# EAGLE design lcdpanel (EAGLE 6.5.0)
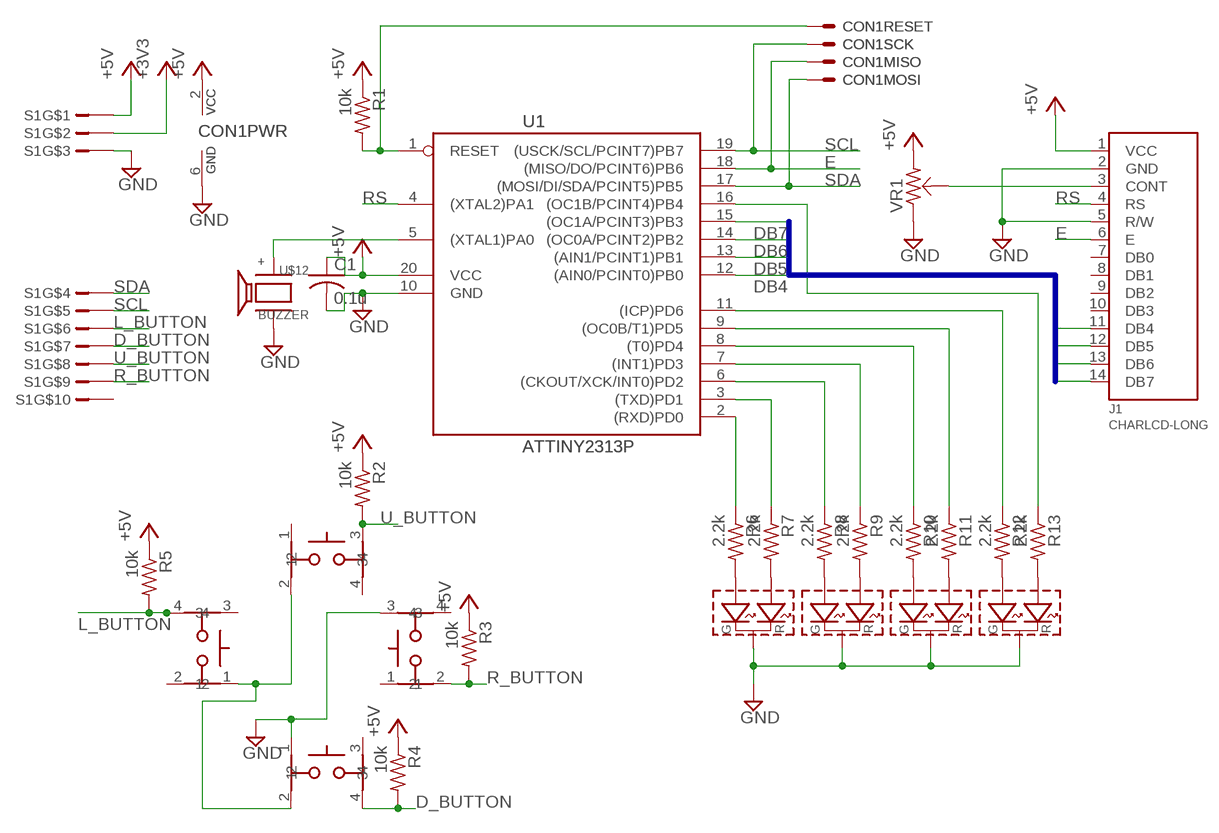
[diagram p0: schematic, sheet 1]

## Parts
C1  0.1u  C-2012  [2012-C]
CON1  AVRISP-NEWSYMBOL-ML6  [ML6]
D1  LED-RG-3MM  [LED-2COL-3MM]
D2  LED-RG-3MM  [LED-2COL-3MM]
D3  LED-RG-3MM  [LED-2COL-3MM]
D4  LED-RG-3MM  [LED-2COL-3MM]
J1  CHARLCD-LONG  [CHARLCD-7X2-LONG]
R1  10k  R-1608  [1608]
R2  10k  R-1608  [1608]
R3  10k  R-1608  [1608]
R4  10k  R-1608  [1608]
R5  10k  R-1608  [1608]
R6  2.2k  R-1608  [1608]
R7  2.2k  R-1608  [1608]
R8  2.2k  R-1608  [1608]
R9  2.2k  R-1608  [1608]
R10  2.2k  R-1608  [1608]
R11  2.2k  R-1608  [1608]
R12  2.2k  R-1608  [1608]
R13  2.2k  R-1608  [1608]
S1  10B-PH  [S10B-PH]
SW1  PUSHSW  [PUSHSW]
SW2  PUSHSW  [PUSHSW]
SW3  PUSHSW  [PUSHSW]
SW4  PUSHSW  [PUSHSW]
U1  ATTINY2313P  [DIL20]
U$12  BUZZER  [BUZZER]
VR1  VR  [VR-637A]

## Nets
+3V3: S1.P$2
+5V: C1.1 CON1.2(PWR:VCC) J1.1(VCC) R1.1 R2.1 R3.1 R4.1 R5.1 S1.P$1 U1.20(VCC) VR1.2
D_BUTTON: R4.2 S1.P$7 SW4.4
DB4: J1.11(DB4) U1.12((AIN0/PCINT0)PB0)
DB5: J1.12(DB5) U1.13((AIN1/PCINT1)PB1)
DB6: J1.13(DB6) U1.14((OC0A/PCINT2)PB2)
DB7: J1.14(DB7) U1.15((OC1A/PCINT3)PB3)
E: CON1.1(MISO:S) J1.6(E) U1.18((MISO/DO/PCINT6)PB6)
GND: C1.2 CON1.6(PWR:GND) D1.K D2.K D3.K D4.K J1.2(GND) J1.5(R/W) S1.P$3 SW3.3 SW4.1 U1.10(GND) U$12.- VR1.1
L_BUTTON: R5.2 S1.P$6 SW2.4
N$1: CON1.5(RESET:S) R1.2 U1.1(RESET)
N$2: SW1.2 SW2.1 SW4.2
N$3: J1.3(CONT) VR1.BR
N$4: D1.YG(G_A) R6.2
N$5: D1.R(R_A) R7.2
N$6: D2.YG(G_A) R8.2
N$7: D3.YG(G_A) R10.2
N$8: D3.R(R_A) R11.2
N$9: D4.YG(G_A) R12.2
N$10: D4.R(R_A) R13.2
N$11: D2.R(R_A) R9.2
N$12: R6.1 U1.2((RXD)PD0)
N$13: R7.1 U1.3((TXD)PD1)
N$14: R8.1 U1.6((CKOUT/XCK/INT0)PD2)
N$15: R9.1 U1.7((INT1)PD3)
N$16: R10.1 U1.8((T0)PD4)
N$17: R11.1 U1.9((OC0B/T1)PD5)
N$18: R12.1 U1.11((ICP)PD6)
N$19: R13.1 U1.16((OC1B/PCINT4)PB4)
N$20: U1.5((XTAL1)PA0) U$12.+
R_BUTTON: R3.2 S1.P$9 SW3.2
RS: J1.4(RS) U1.4((XTAL2)PA1)
SCL: CON1.3(SCK:S) S1.P$5 U1.19((USCK/SCL/PCINT7)PB7)
SDA: CON1.4(MOSI:S) S1.P$4 U1.17((MOSI/DI/SDA/PCINT5)PB5)
U_BUTTON: R2.2 S1.P$8 SW1.3
Unconnected: J1.7(DB0) J1.8(DB1) J1.9(DB2) J1.10(DB3) S1.P$10 SW1.1 SW1.4 SW2.2 SW2.3 SW3.1 SW3.4 SW4.3

## Buses
DB[4..7]

## Library data of the parts
C1 = Passive_Robotech:C
CON1 = Connector_Robotech:AVRISP-NEWSYMBOL
D1-D4 = pizaid:LED-RG
J1 = pizaid:CHARLCD
R1-R13 = Passive_Robotech:R
S1 = con-jst:?10B-PH
SW1-SW4 = Passive_Robotech:PUSHSW
U1 = MicroControler_Robotech:ATTINY2313
U$12 = pizaid:BUZZER
VR1 = Passive_Robotech:VR

## Board
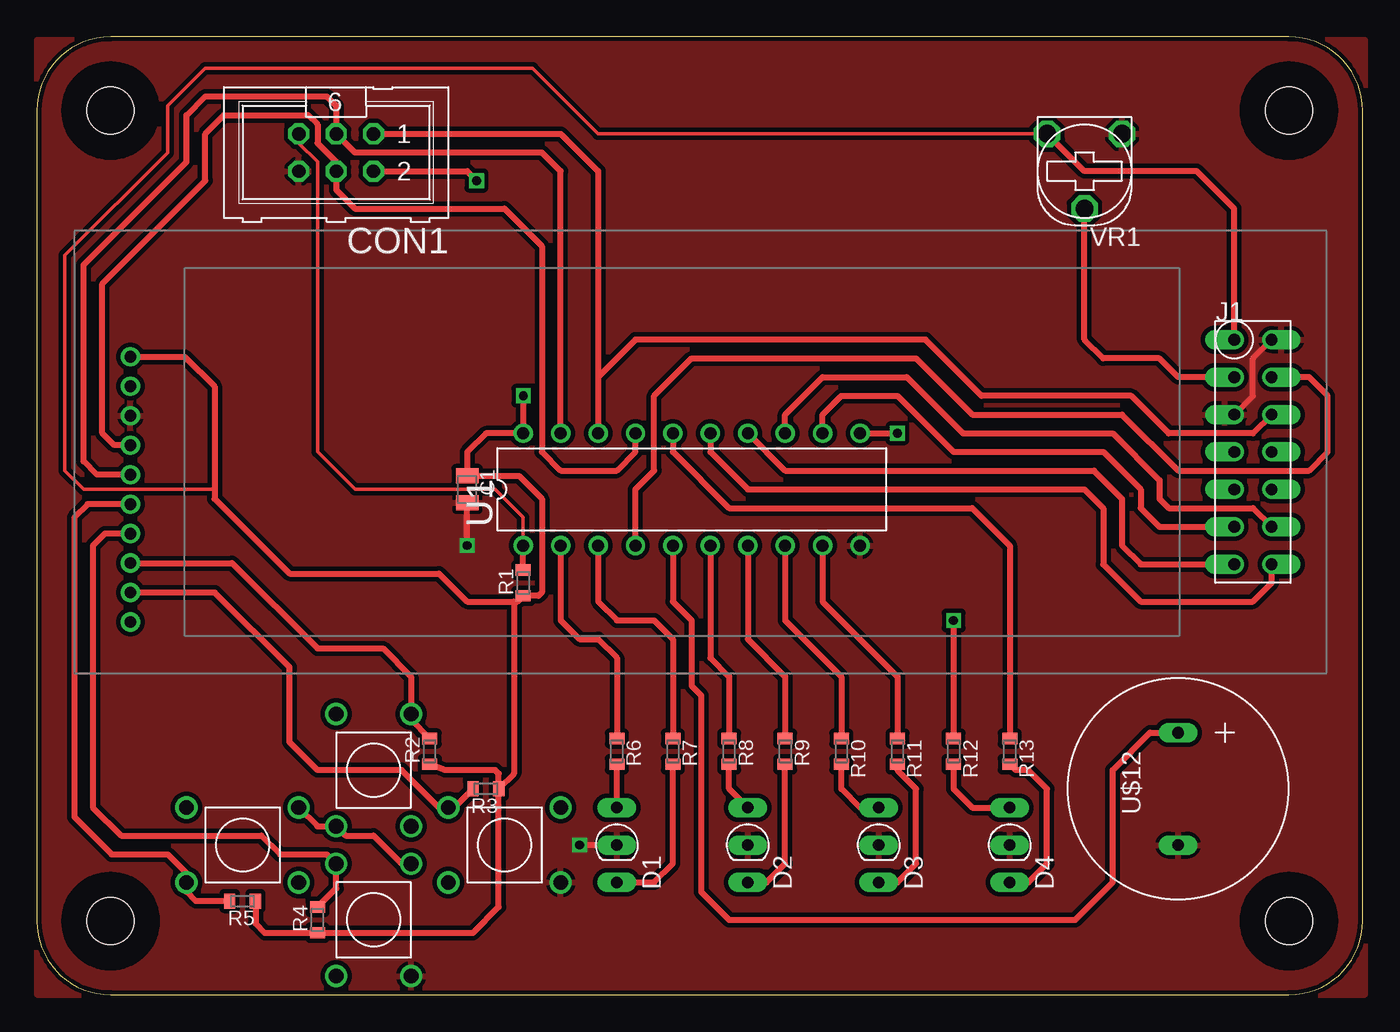
[diagram p1: board, top side]
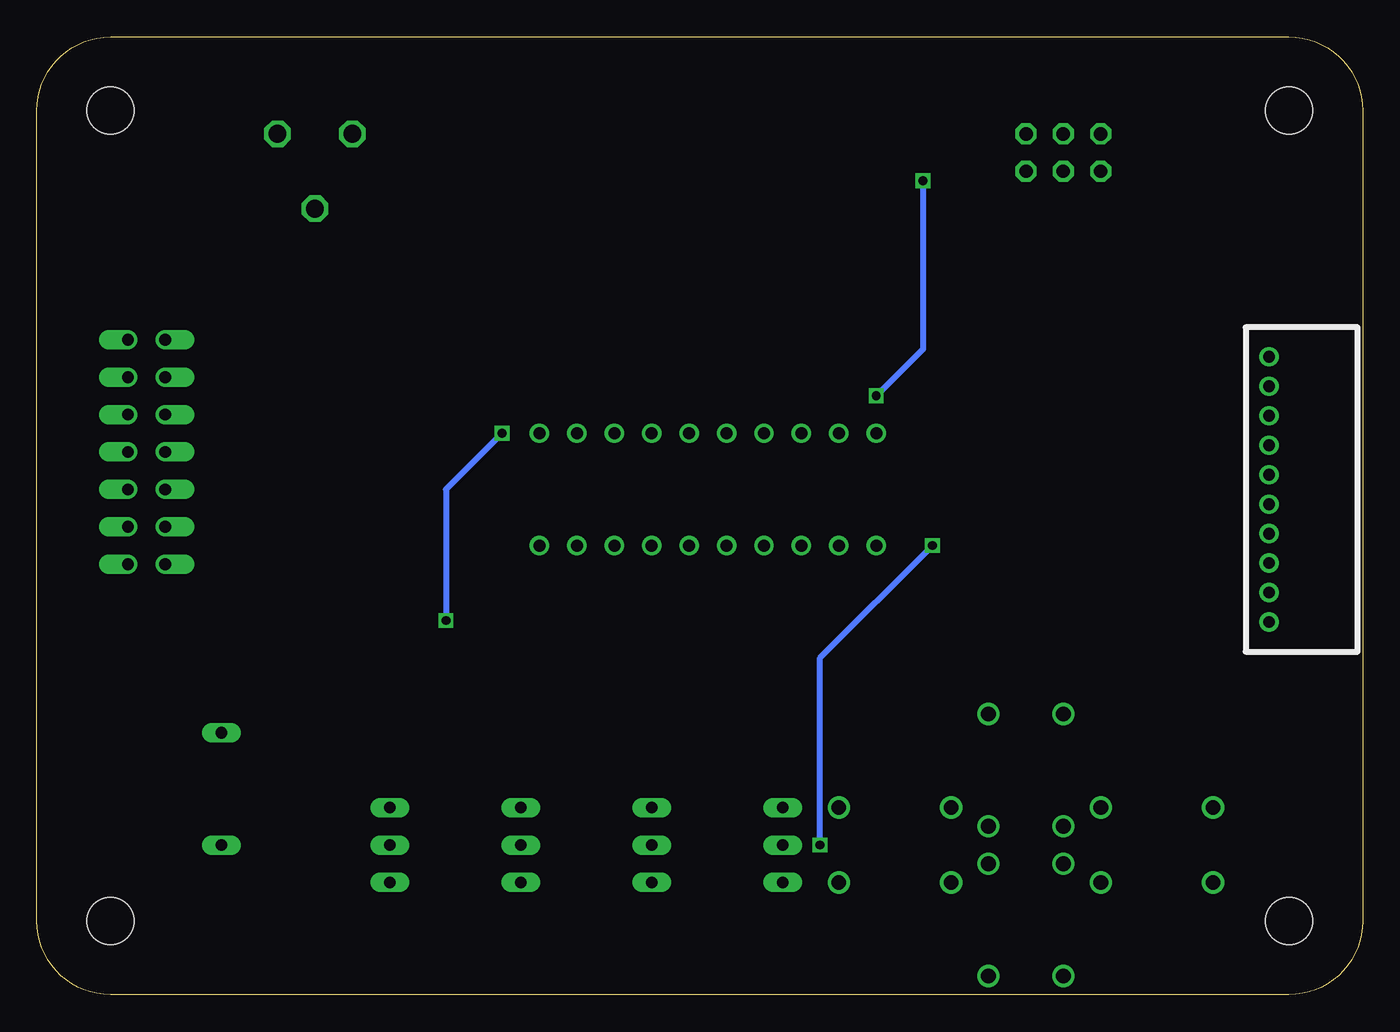
[diagram p2: board, bottom side, seen from below]

Size 90 x 65 mm. Coordinates in mm from the lower left corner, seen from the top.
Outline: 0,5 arc90 5,0 85,0 arc90 90,5 90,60 arc90 85,65 5,65 arc90 0,60 0,5
Copper layers (1*16): Top 0.0356mm / dielectric 1.5011mm / Bottom 0.0356mm
Design rules "formita": minimum track width 10mil, minimum drill 0.5994mm, track to track 0.3mm, track to pad 0.3mm, pad to pad 0.3mm, via to via 0.3mm, smd to smd 8mil, copper to edge 8mil, drill to drill 8mil, minimum pad ring 10mil, minimum via ring 8mil, stop-mask expansion 4mil, vias tented up to drill 0mil, thermal gap 10mil
Holes 3.2 mm at 5,5 85,5 85,60 5,60
tRestrict: area 2,2 to 8,8; area 82,2 to 88,8; area 82,57 to 88,63; area 2,57 to 8,63

### Footprints (pad centres in the part's own frame; a part is rotated, then mirrored left to right if it is on the bottom)
2012-C = smd 1.016 x 1.524: 1 -0.921,0; 2 0.921,0
ML6 = drill 0.914 octagon: 1 -2.54,-1.27; 2 -2.54,1.27; 3 0,-1.27; 4 0,1.27; 5 2.54,-1.27; 6 2.54,1.27
LED-2COL-3MM = drill 0.8 long: K 0,0; R 0,-2.54; YG 0,2.54
CHARLCD-7X2-LONG = drill 0.8 offset: 1 -1.27,7.62; 2 1.27,7.62; 3 -1.27,5.08; 4 1.27,5.08; 5 -1.27,2.54; 6 1.27,2.54; 7 -1.27,0; 8 1.27,0; 9 -1.27,-2.54; 10 1.27,-2.54; 11 -1.27,-5.08; 12 1.27,-5.08; 13 -1.27,-7.62; 14 1.27,-7.62
1608 = smd 0.762 x 1.016: 1 -0.875,0; 2 0.875,0
S10B-PH = drill 0.8: P$1 -9,0; P$2 -7,0; P$3 -5,0; P$4 -3,0; P$5 -1,0; P$6 1,0; P$7 3,0; P$8 5,0; P$9 7,0; P$10 9,0
PUSHSW = drill 1: 1 -2.54,3.81; 2 -2.54,-3.81; 3 2.54,3.81; 4 2.54,-3.81
DIL20 = drill 0.813: 1 -11.43,-3.81; 2 -8.89,-3.81; 3 -6.35,-3.81; 4 -3.81,-3.81; 5 -1.27,-3.81; 6 1.27,-3.81; 7 3.81,-3.81; 8 6.35,-3.81; 9 8.89,-3.81; 10 11.43,-3.81; 11 11.43,3.81; 12 8.89,3.81; 13 6.35,3.81; 14 3.81,3.81; 15 1.27,3.81; 16 -1.27,3.81; 17 -3.81,3.81; 18 -6.35,3.81; 19 -8.89,3.81; 20 -11.43,3.81
BUZZER = drill 0.8 long: + -3.81,0; - 3.81,0
VR-637A = drill 1.2 octagon: 1 -2.54,-2.54; 2 2.54,-2.54; BR 0,2.54

### Placement (x,y rotation side)
C1  29.21,34.29 270 top
CON1  20.32,57.15 180 top
D1  39.37,10.16 0 top
D2  48.26,10.16 0 top
D3  57.15,10.16 0 top
D4  66.04,10.16 0 top
J1  82.55,36.83 0 top
R1  33.02,27.94 90 top
R2  26.67,16.51 90 top
R3  30.48,13.97 180 top
R4  19.05,5.08 90 top
R5  13.97,6.35 180 top
R6  39.37,16.51 270 top
R7  43.18,16.51 270 top
R8  46.99,16.51 270 top
R9  50.8,16.51 270 top
R10  54.61,16.51 270 top
R11  58.42,16.51 270 top
R12  62.23,16.51 270 top
R13  66.04,16.51 270 top
S1  6.35,34.29 270 bottom
SW1  22.86,15.24 0 top
SW2  13.97,10.16 270 top
SW3  31.75,10.16 270 top
SW4  22.86,5.08 180 top
U1  44.45,34.29 0 top
U$12  77.47,13.97 270 top
VR1  71.12,55.88 180 top

### Tracks (layer width: path | path; a pad name or v marks a point on that pad's centre or on a via)
+5V  (via drill 0.6)
  Top 0.254: VR1.2 38.1,58.42 33.66,62.87 11.43,62.87 8.89,60.33 8.89,57.15 1.91,50.16 1.91,35.56 3.17,34.29 12.06,34.29
  Top 0.406: J1.1 81.28,53.34 78.74,55.88 71.12,55.88 VR1.2 | R3.1 31.36,15 31.11,15.24 27.7,15.24 R2.1 | R5.1 14.85,4.84 15.48,4.21 R4.1 29.61,4.21 31.36,5.96 R3.1 | S1.P$1 10.05,43.29 12.06,41.27 12.06,34.29 12.06,33.66 17.14,28.57 27.3,28.57 29.21,26.67 32.38,26.67 | 32.38,26.67 32.62,26.67 R1.1 34.05,27.07 34.29,27.3 34.29,33.66 32.73,35.21 C1.1 29.21,36.83 30.48,38.1 U1.20 v33.02,40.64 | 32.38,26.67 32.38,15 R3.1 | CON1.2 29.21,55.88 v29.84,55.24
  Bottom 0.406: v29.84,55.24 29.84,43.81 v33.02,40.64
D_BUTTON
  Top 0.406: S1.P$7 4.62,31.29 3.81,30.48 3.81,12.7 5.71,10.79 15.24,10.79 16.51,9.53 19.68,9.53 SW4.4 20.32,7.22 R4.2
DB4
  Top 0.406: U1.12 53.34,39.37 54.61,40.64 58.42,40.64 62.23,36.83 72.39,36.83 74.93,34.29 74.93,33.02 76.2,31.75 J1.11
DB5
  Top 0.406: U1.13 50.8,39.37 53.34,41.91 59.05,41.91 62.87,38.1 73.03,38.1 76.2,34.92 76.2,33.66 76.83,33.02 82.55,33.02 J1.12
DB6
  Top 0.406: U1.14 50.8,35.56 71.75,35.56 73.66,33.66 73.66,30.48 74.93,29.21 J1.13
DB7
  Top 0.406: U1.15 45.72,36.83 48.26,34.29 71.12,34.29 72.39,33.02 72.39,29.21 74.93,26.67 82.55,26.67 83.82,27.94 J1.14
E
  Top 0.406: J1.6 82.55,38.1 76.83,38.1 74.3,40.64 64.14,40.64 60.33,44.45 40.64,44.45 38.1,41.91 | 38.1,41.91 U1.18 | CON1.1 35.56,58.42 38.1,55.88 38.1,41.91
GND  (via drill 0.6)
  Top 0.406: J1.5 82.55,40.64 82.55,43.18 J1.2 | D1.K v36.83,10.16 | v29.21,30.48 C1.2
  Bottom 0.406: v36.83,10.16 36.83,22.86 v29.21,30.48
  pour Top (isolate 0.305): 0,64.77 0,0 90.17,0 90.17,64.77
L_BUTTON
  Top 0.406: S1.P$6 3.44,33.29 2.54,32.38 2.54,12.06 5.08,9.53 8.89,9.53 10.16,8.26 SW2.4 10.16,6.99 10.79,6.35 R5.2
N$1
  Top 0.254: CON1.5 17.78,57.78 19.05,56.52 19.05,36.83 21.59,34.29 31.11,34.29 33.02,32.38 U1.1
  Top 0.406: R1.2 U1.1
N$2
  Top 0.406: SW2.1 19.05,11.43 SW1.2 20.95,10.79 22.86,10.79 24.77,8.89 SW4.2
N$3
  Top 0.406: J1.3 77.47,41.91 76.2,43.18 72.39,43.18 71.12,44.45 VR1.BR
N$4
  Top 0.406: D1.YG R6.2
N$5
  Top 0.406: D1.R 41.91,7.62 43.18,8.89 R7.2
N$6
  Top 0.406: D2.YG 46.99,13.97 R8.2
N$7
  Top 0.406: D3.YG 55.88,12.7 54.61,13.97 R10.2
N$8
  Top 0.406: D3.R 58.42,7.62 59.69,8.89 59.69,13.97 58.42,15.24 R11.2
N$9
  Top 0.406: R12.2 62.23,13.97 63.5,12.7 D4.YG
N$10
  Top 0.406: D4.R 67.31,7.62 68.58,8.89 68.58,13.97 67.31,15.24 66.44,15.24 R13.2
N$11
  Top 0.406: D2.R 49.53,7.62 50.8,8.89 R9.2
N$12
  Top 0.406: U1.2 35.56,25.4 36.83,24.13 38.1,24.13 39.37,22.86 R6.1
N$13
  Top 0.406: U1.3 38.1,26.67 39.37,25.4 41.91,25.4 43.18,24.13 R7.1
N$14
  Top 0.406: U1.6 45.72,22.86 46.99,21.59 R8.1
N$15
  Top 0.406: U1.7 48.26,24.13 50.8,21.59 R9.1
N$16
  Top 0.406: U1.8 50.8,25.4 54.61,21.59 R10.1
N$17
  Top 0.406: U1.9 53.34,26.67 58.42,21.59 R11.1
N$18  (via drill 0.6)
  Top 0.406: U1.11 v58.42,38.1 | v62.23,25.4 R12.1
  Bottom 0.406: v58.42,38.1 62.23,34.29 v62.23,25.4
N$19
  Top 0.406: U1.16 43.18,36.83 46.99,33.02 63.5,33.02 66.04,30.48 R13.1
N$20
  Top 0.406: U1.5 43.18,26.67 44.45,25.4 44.45,20.95 45.09,20.32 45.09,6.99 46.99,5.08 70.48,5.08 73.03,7.62 73.03,15.24 75.56,17.78 U$12.+
N$21
  pour Top: 38.1,64.14 38.1,60.33 81.28,60.33 81.28,64.14
N$22
  pour Top: 24.13,59.69 26.67,59.69 26.67,62.23 24.13,62.23
R_BUTTON
  Top 0.406: S1.P$9 12.08,27.29 17.14,22.23 17.14,17.14 19.05,15.24 24.77,15.24 27.3,12.7 SW3.2 28.34,12.7 R3.2
RS
  Top 0.406: U1.4 40.64,34.29 41.91,35.56 41.91,40.64 44.45,43.18 59.69,43.18 63.5,39.37 73.66,39.37 77.47,35.56 86.36,35.56 87.63,36.83 87.63,40.64 86.36,41.91 J1.4
SCL
  Top 0.406: U1.19 35.56,55.88 34.29,57.15 21.59,57.15 CON1.3 20.32,60.33 19.68,60.96 11.43,60.96 10.16,59.69 10.16,56.52 3.17,49.53 3.17,36.2 4.08,35.29 S1.P$5
SDA
  Top 0.406: S1.P$4 5.25,37.29 4.45,38.1 4.45,48.26 11.43,55.24 11.43,58.42 12.7,59.69 18.41,59.69 19.05,59.05 19.05,57.78 20.32,56.52 CON1.4 20.32,54.61 21.59,53.34 31.75,53.34 34.29,50.8 34.29,36.83 35.56,35.56 39.37,35.56 40.64,36.83 U1.17
U_BUTTON
  Top 0.406: S1.P$8 13.26,29.29 19.05,23.5 23.5,23.5 25.4,21.59 SW1.3 25.4,18.66 R2.2

### Text on the board
tRestrict: Pizaid LCD Panel 2014/08/10 | 1